# EAGLE board lower_pcb (EAGLE 9.6.2), part 1 of 2
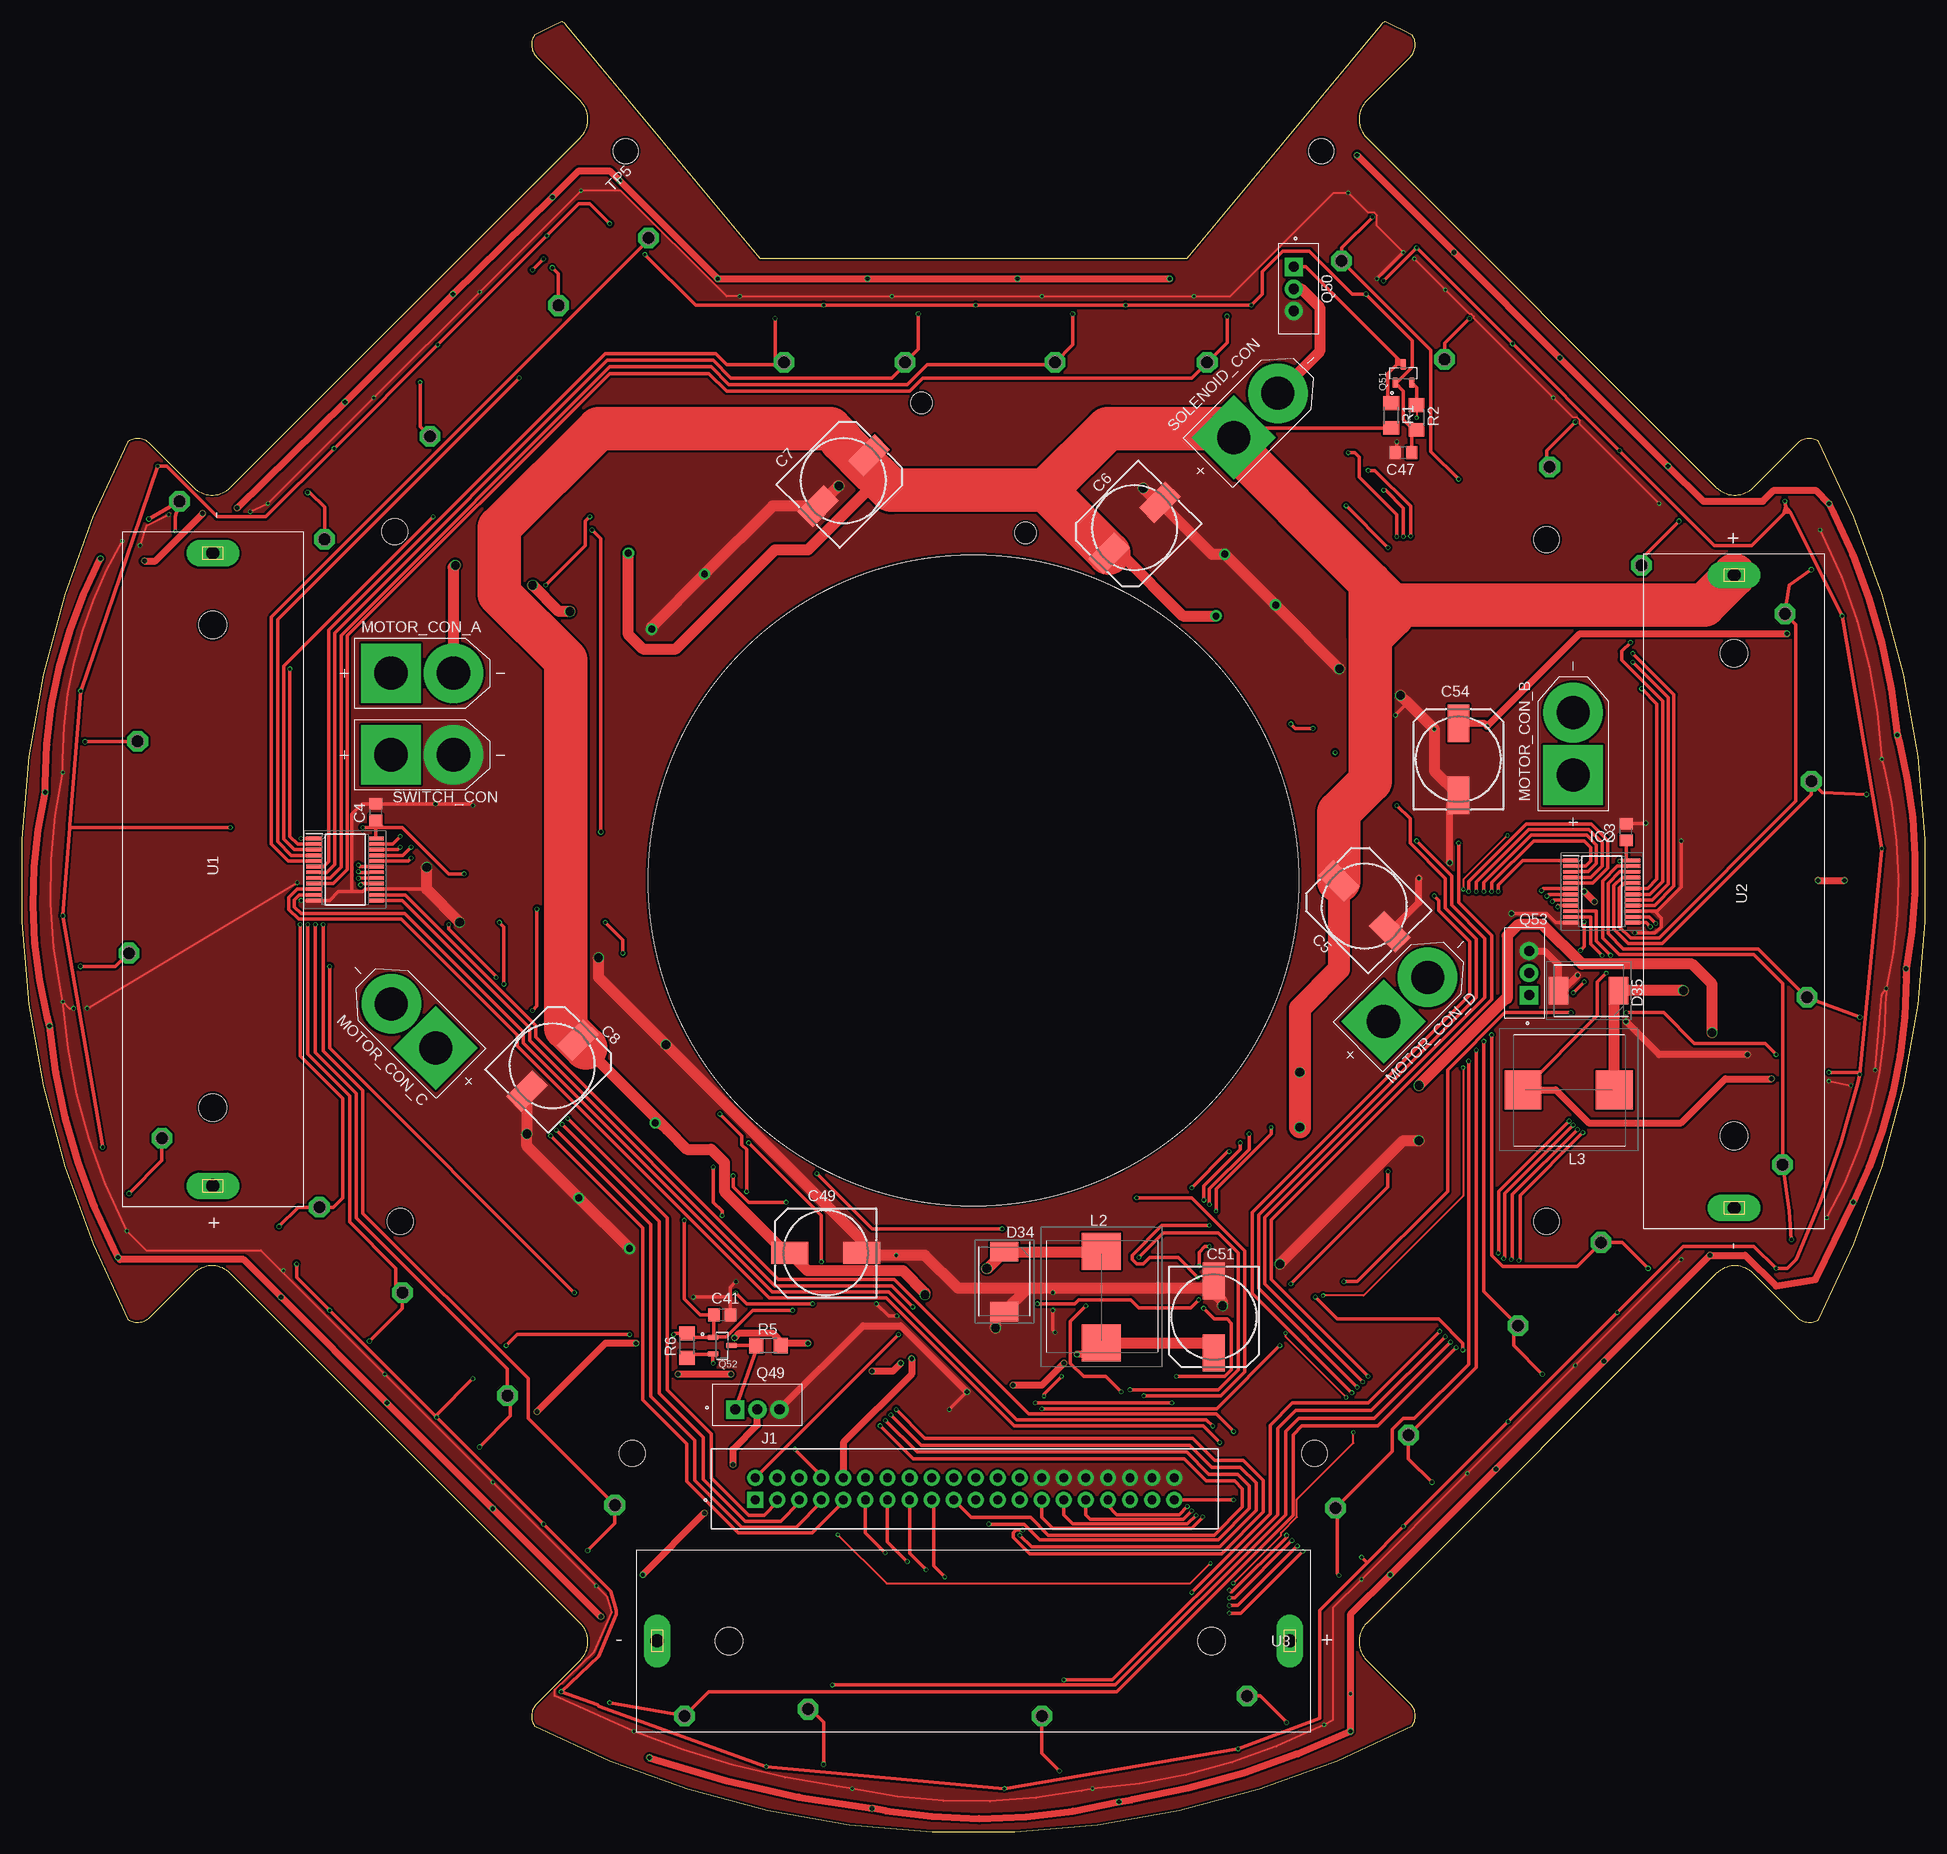
[diagram p2: board, top side]
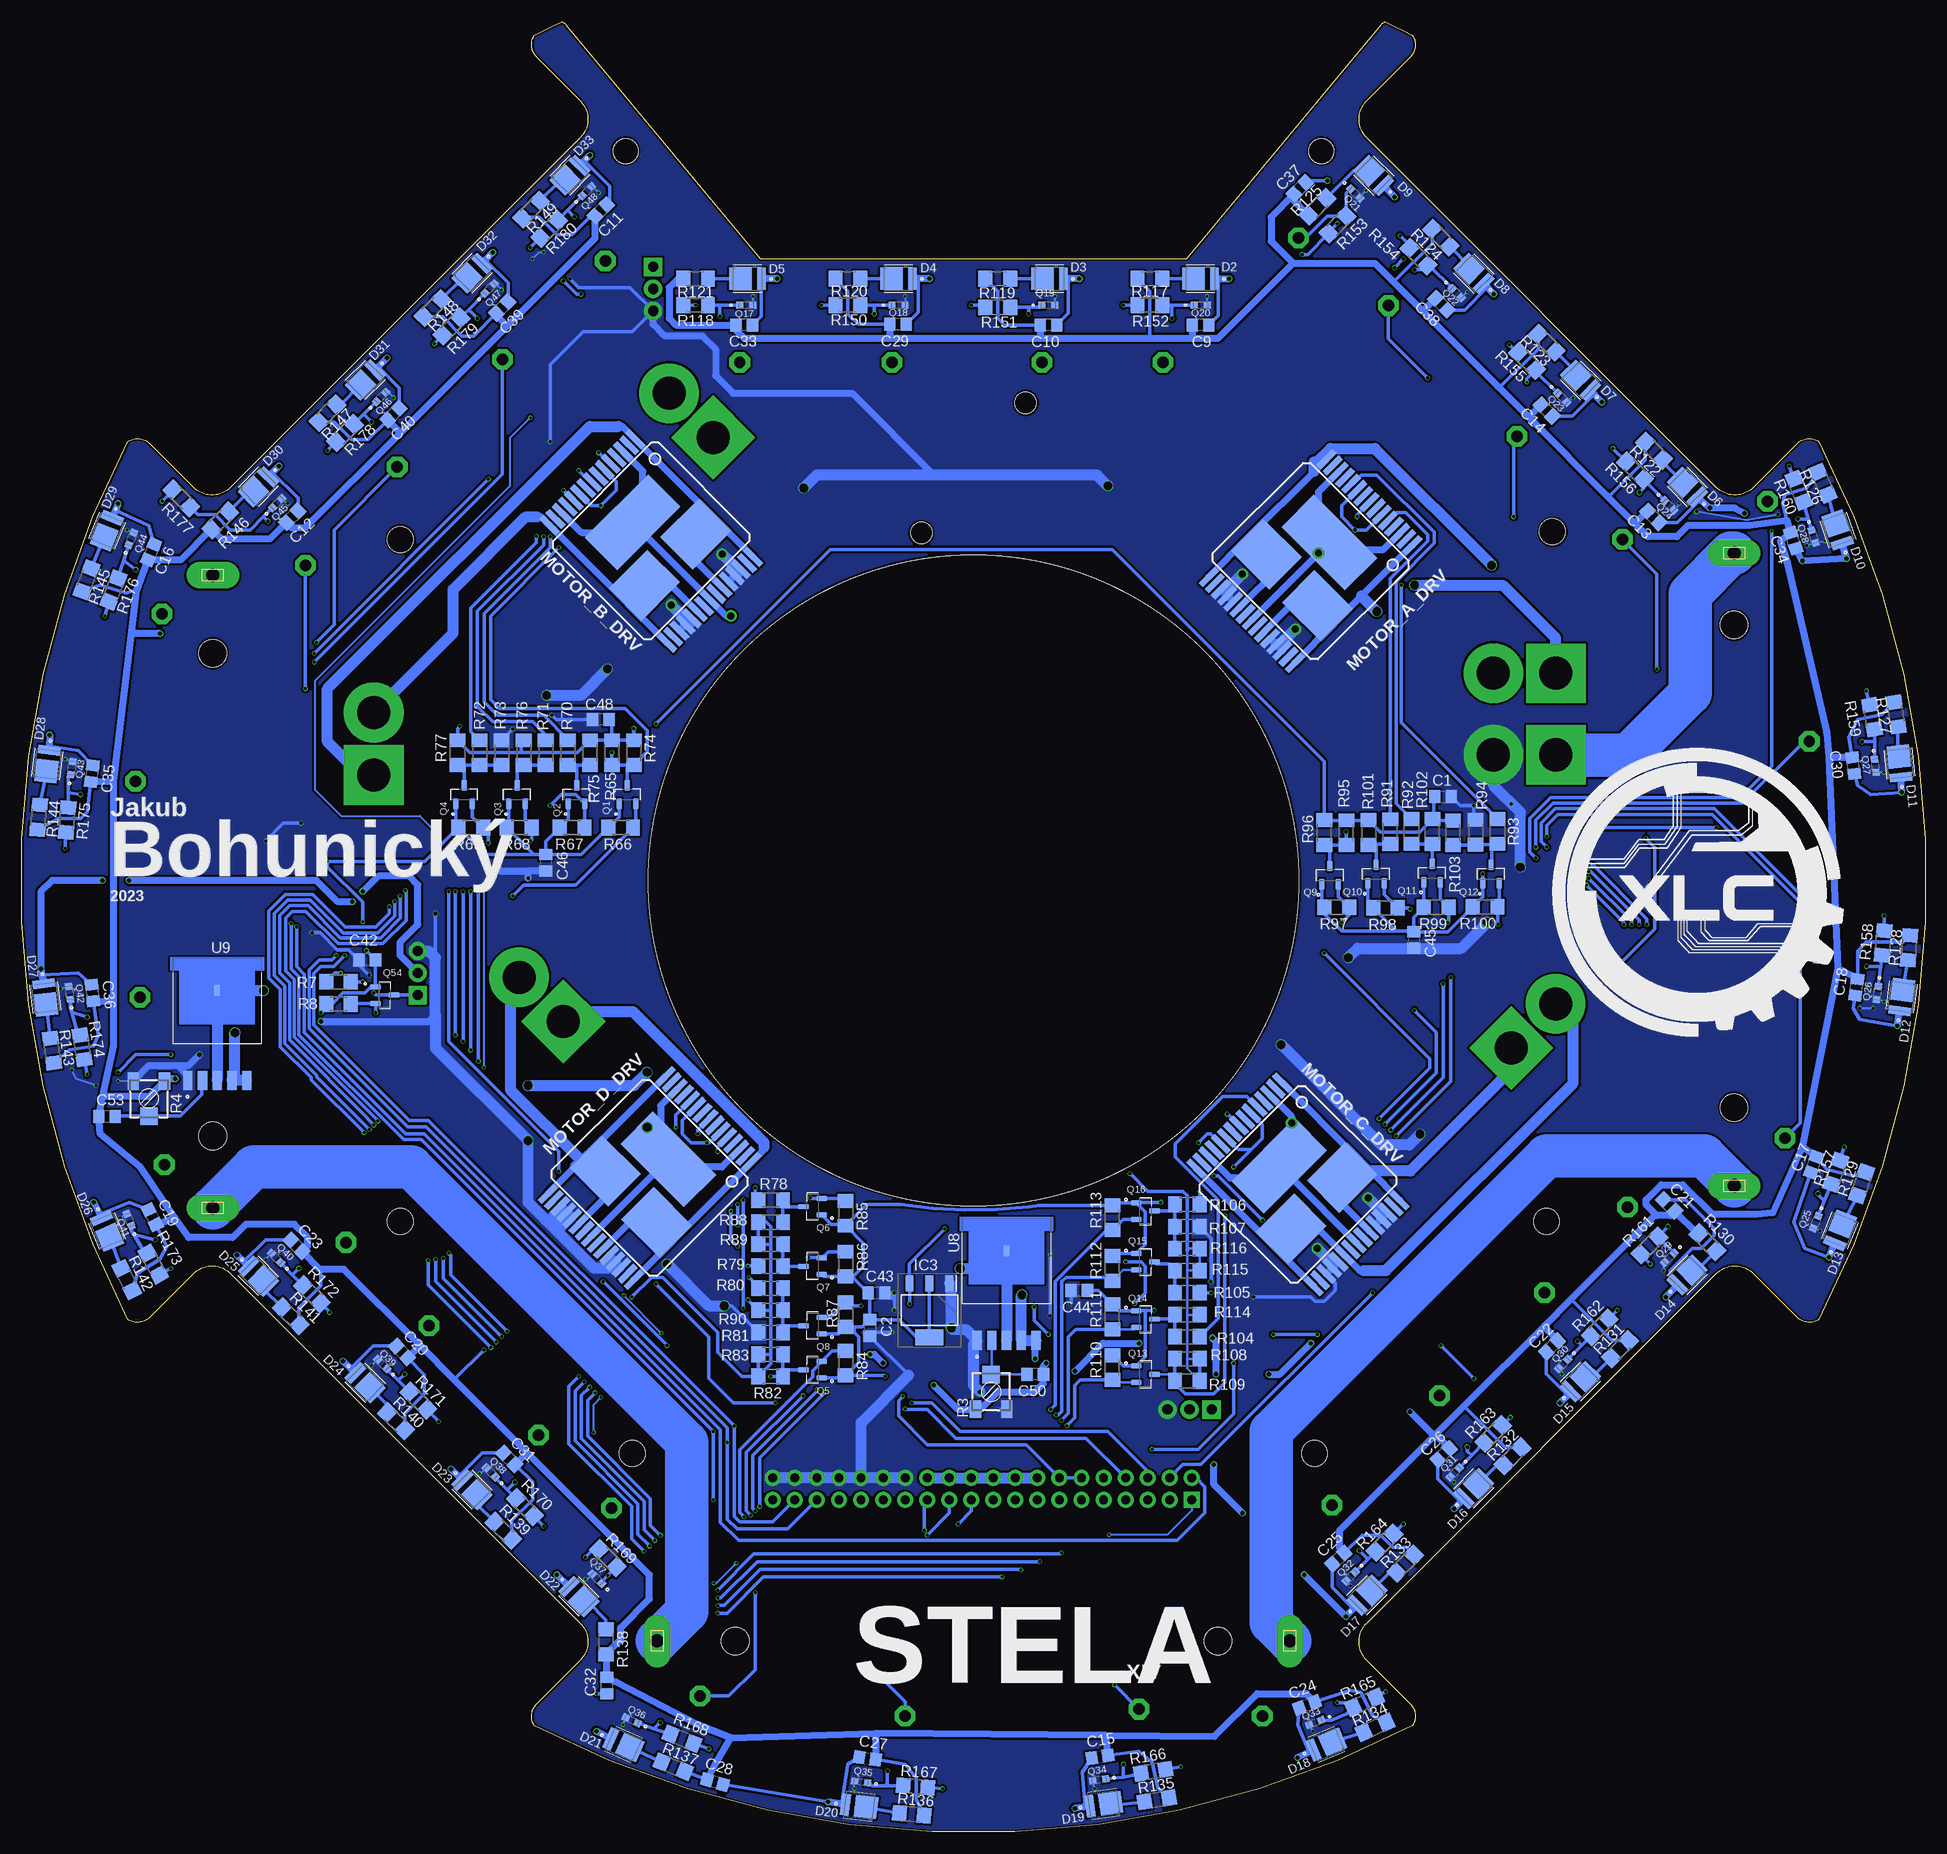
[diagram p3: board, bottom side, seen from below]

Size 219.29 x 208.61 mm. Coordinates in mm from the lower left corner, seen from the top.
Outline: 195.24,154.94 154.94,195.24 arc-90 154.94,199.48 159.97,204.52 arc79 160.22,207.05 arc2 157.1,208.61 arc35 156.6,208.28 134.2,181.3 85.09,181.3 62.69,208.28 arc35 62.19,208.61 arc2 59.07,207.05 arc79 59.32,204.52 64.36,199.48 arc-90 64.36,195.24 24.05,154.94 arc-90 19.81,154.94 14.77,159.97 arc79 12.24,160.22 arc55 12.24,59.07 arc79 14.77,59.32 19.81,64.36 arc-90 24.05,64.36 64.36,24.05 arc-90 64.36,19.81 59.32,14.77 arc79 59.07,12.24 arc55 160.22,12.24 arc79 159.97,14.77 154.94,19.81 arc-90 154.94,24.05 195.24,64.36 arc-90 199.48,64.36 204.52,59.32 arc79 207.05,59.07 arc55 207.05,160.22 arc79 204.52,159.97 199.48,154.94 arc-90 195.24,154.94
Copper layers (1*16): Top 0.035mm / dielectric 1.6mm / Bottom 0.035mm
Design rules "jlc_pcb": minimum track width 5mil, minimum drill 0.3mm, track to track 5mil, track to pad 5mil, pad to pad 5mil, via to via 5mil, smd to smd 5mil, copper to edge 0.2mm, drill to drill 6mil, minimum pad ring 10mil, minimum via ring 3mil, stop-mask expansion 4mil, vias tented up to drill 0mil, thermal gap 10mil
Holes 2.5 mm at 103.65,164.68 115.65,149.68
Holes 2.9 mm at 149.72,193.7 69.58,193.7
Holes 3 mm at 43.63,70.35 148.94,43.63 42.95,149.84 175.66,70.35 70.35,43.63 175.66,148.94
Holes 75 mm at 109.65,109.65

## Footprints (pad centres in the part's own frame; a part is rotated, then mirrored left to right if it is on the bottom)
C0805 = smd 1.3 x 1.5: 1 -0.95,0; 2 0.95,0
150CLZ-1010 = smd 4.3 x 2.5: + 4.15,0; - -4.15,0
LED_OF-SMD2835Y = smd 2.6 x 2.55: A 0.8,0 | smd 1 x 2.55: C -1.6,0
DIOM8059X256N = smd 2.25 x 3.2: 1 -3.45,0; 2 3.45,0
SOP65P780X200-24N = smd 1.8 x 0.45: 1 -3.55,3.575; 2 -3.55,2.925; 3 -3.55,2.275; 4 -3.55,1.625; 5 -3.55,0.975; 6 -3.55,0.325; 7 -3.55,-0.325; 8 -3.55,-0.975; 9 -3.55,-1.625; 10 -3.55,-2.275; 11 -3.55,-2.925; 12 -3.55,-3.575; 13 3.55,-3.575; 14 3.55,-2.925; 15 3.55,-2.275; 16 3.55,-1.625; 17 3.55,-0.975; 18 3.55,-0.325; 19 3.55,0.325; 20 3.55,0.975; 21 3.55,1.625; 22 3.55,2.275; 23 3.55,2.925; 24 3.55,3.575
SOT230P700X180-4N = smd 1.85 x 0.9: 1 -3.1,2.3; 2 -3.1,0; 3 -3.1,-2.3 | smd 1.85 x 3.2: 4 3.1,0
SAMTEC_TST-120-02-S-D = drill 1.02 pad 1.37 square: 01 0,0 | drill 1.02 pad 1.37: 02 0,2.54; 03 2.54,0; 04 2.54,2.54; 05 5.08,0; 06 5.08,2.54; 07 7.62,0; 08 7.62,2.54; 09 10.16,0; 10 10.16,2.54; 11 12.7,0; 12 12.7,2.54; 13 15.24,0; 14 15.24,2.54; 15 17.78,0; 16 17.78,2.54; 17 20.32,0; 18 20.32,2.54; 19 22.86,0; 20 22.86,2.54; 21 25.4,0; 22 25.4,2.54; 23 27.94,0; 24 27.94,2.54; 25 30.48,0; 26 30.48,2.54; 27 33.02,0; 28 33.02,2.54; 29 35.56,0; 30 35.56,2.54; 31 38.1,0; 32 38.1,2.54; 33 40.64,0; 34 40.64,2.54; 35 43.18,0; 36 43.18,2.54; 37 45.72,0; 38 45.72,2.54; 39 48.26,0; 40 48.26,2.54
WE-HCI_1350/136523 = smd 4.25 x 4.5: 1 -5.25,0; 2 5.27,0
MULTIPOWER30 = smd 10.3 x 5.25: 31 0,-3.05 | smd 6.23 x 5.25: 32 4.165,3.05; 33 -4.165,3.05 | smd 0.68 x 2.6: P$1 -7,-9.6; P$2 -6,-9.6; P$3 -5,-9.6; P$4 -4,-9.6; P$5 -3,-9.6; P$6 -2,-9.6; P$7 -1,-9.6; P$8 0,-9.6; P$9 1,-9.6; P$10 2,-9.6; P$11 3,-9.6; P$12 4,-9.6; P$13 5,-9.6; P$14 6,-9.6; P$15 7,-9.6; P$16 7,9.6; P$17 6,9.6; P$18 5,9.6; P$19 4,9.6; P$20 3,9.6; P$21 2,9.6; P$22 1,9.6; P$23 0,9.6; P$24 -1,9.6; P$25 -2,9.6; P$26 -3,9.6; P$27 -4,9.6; P$28 -5,9.6; P$29 -6,9.6; P$30 -7,9.6
AMASS_XT60-M = drill 3.81 pad 3.886: N 3.6,0 | drill 3.81 pad 3.886 square: P -3.6,0
SOT95P240X111-3N = smd 1.23 x 0.6: 1 -1.06,0.95; 2 -1.06,-0.95; 3 1.06,0
XDCR_PT19-21B/L41/TR8 = smd 0.8 x 0.8: C -0.75,0; E 0.75,0
TO254P1036X470X1965-3 = drill 1.17 square: 1 -2.54,0 | drill 1.17: 2 0,0; 3 2.54,0
R1206 = smd 1.6 x 1.803: 1 -1.422,0; 2 1.422,0
RTRIM3314J = smd 1.3 x 2: 1 1.8,-2; 3 -1.8,-2 | smd 2 x 2: 2 0,2
P1-13 = drill 1.321 pad 2.159 octagon: TP 0,0
BAT_BH-18650-PC = drill 1.524 pad 3.048 long: N -36.45,0; P 36.45,0 | hole 3.2: -28.17,0; 27.44,0
CONV_XL4015 = smd 2.16 x 1.07: 1 -10.335,3.4; 2 -10.335,1.7; 3 -10.335,0; 4 -10.335,-1.7; 5 -10.335,-3.4 | smd 1.27 x 0.635: 3.1 0,0

## Placement (x,y rotation side)
C1  100nF  [C0805]  55.54,119.3 0 bottom
C2  100nF  [C0805]  121.58,58.08 270 bottom
C3  100nF  [C0805]  184.83,115.23 90 top
C4  100nF  [C0805]  40.81,117.52 90 top
C5  470uF  [150CLZ-1010]  154.68,106.67 135 top
C6  470uF  [150CLZ-1010]  128.19,150.29 225 top
C7  470uF  [150CLZ-1010]  94.68,155.73 45 top
C8  470uF  [150CLZ-1010]  61.13,88.31 45 top
C9  100nF  [C0805]  83.48,173.65 180 bottom
C10  100nF  [C0805]  101.01,173.65 180 bottom
C11  100nF  [C0805]  152.57,186.86 225 bottom
C12  100nF  [C0805]  188.13,151.56 225 bottom
C13  100nF  [C0805]  31.33,151.53 135 bottom
C14  100nF  [C0805]  43.61,163.8 135 bottom
C15  100nF  [C0805]  95.09,8.67 9 bottom
C16  100nF  [C0805]  204.39,147.49 247 bottom
C17  100nF  [C0805]  12.85,76.89 70 bottom
C18  100nF  [C0805]  7.93,97.34 82 bottom
C19  100nF  [C0805]  204.25,70.85 296 bottom
C20  100nF  [C0805]  175.48,55.31 314 bottom
C21  100nF  [C0805]  29.5,72.21 315 bottom
C22  100nF  [C0805]  42.99,55.96 45 bottom
C23  100nF  [C0805]  187.64,67.55 315 bottom
C24  100nF  [C0805]  71.22,14.63 21 bottom
C25  100nF  [C0805]  67.61,31.51 43 bottom
C26  100nF  [C0805]  55.49,43.55 44 bottom
C27  100nF  [C0805]  121.86,8.48 352 bottom
C28  100nF  [C0805]  139.42,5.75 164 bottom
C29  100nF  [C0805]  118.33,173.72 180 bottom
C30  100nF  [C0805]  8.29,122.88 97 bottom
C31  100nF  [C0805]  163.13,43.01 315 bottom
C32  100nF  [C0805]  151.89,16.88 90 bottom
C33  100nF  [C0805]  136.06,173.65 180 bottom
C34  100nF  [C0805]  15.21,148.82 109 bottom
C35  100nF  [C0805]  211.21,121.96 263 bottom
C36  100nF  [C0805]  211.16,96.69 276 bottom
C37  100nF  [C0805]  72.05,189.4 225 bottom
C38  100nF  [C0805]  55.74,176.05 135 bottom
C39  100nF  [C0805]  163.94,175.66 225 bottom
C40  100nF  [C0805]  176.46,163.39 225 bottom
C41  100nF  [C0805]  80.69,59.61 0 top
C42  100nF  [C0805]  179.5,100.5 180 bottom
C43  100nF  [C0805]  120.82,62.15 0 bottom
C44  100nF  [C0805]  97.45,62.4 180 bottom
C45  100nF  [C0805]  58.93,102.77 270 bottom
C46  100nF  [C0805]  158.92,111.68 270 bottom
C47  100nF  [C0805]  159.18,158.92 180 top
C48  100nF  [C0805]  152.57,128.19 180 bottom
C49  470uF  [150CLZ-1010]  92.63,66.72 180 top
C50  100nF  [C0805]  102.53,52.75 180 bottom
C51  470uF  [150CLZ-1010]  137.33,59.35 270 top
C53  100nF  [C0805]  209.47,82.47 0 bottom
C54  470uF  [150CLZ-1010]  165.53,123.62 90 top
D2  OF-SMD2835Y  [LED_OF-SMD2835Y]  83.48,178.99 180 bottom
D3  OF-SMD2835Y  [LED_OF-SMD2835Y]  100.88,178.99 180 bottom
D4  OF-SMD2835Y  [LED_OF-SMD2835Y]  118.28,178.99 180 bottom
D5  OF-SMD2835Y  [LED_OF-SMD2835Y]  135.68,178.99 180 bottom
D6  OF-SMD2835Y  [LED_OF-SMD2835Y]  27.39,154.98 135 bottom
D7  OF-SMD2835Y  [LED_OF-SMD2835Y]  39.7,167.28 135 bottom
D8  OF-SMD2835Y  [LED_OF-SMD2835Y]  52,179.58 135 bottom
D9  OF-SMD2835Y  [LED_OF-SMD2835Y]  63.54,190.87 135 bottom
D10  OF-SMD2835Y  [LED_OF-SMD2835Y]  10.08,150.03 109 bottom
D11  OF-SMD2835Y  [LED_OF-SMD2835Y]  2.97,123.13 96 bottom
D12  OF-SMD2835Y  [LED_OF-SMD2835Y]  2.71,96.23 82 bottom
D13  OF-SMD2835Y  [LED_OF-SMD2835Y]  9.82,69.33 68 bottom
D14  OF-SMD2835Y  [LED_OF-SMD2835Y]  27.42,64.2 45 bottom
D15  OF-SMD2835Y  [LED_OF-SMD2835Y]  39.73,51.89 45 bottom
D16  OF-SMD2835Y  [LED_OF-SMD2835Y]  52.03,39.59 45 bottom
D17  OF-SMD2835Y  [LED_OF-SMD2835Y]  64.33,27.29 45 bottom
D18  OF-SMD2835Y  [LED_OF-SMD2835Y]  69.01,10.08 23 bottom
D19  OF-SMD2835Y  [LED_OF-SMD2835Y]  94.64,3.22 8 bottom
D20  OF-SMD2835Y  [LED_OF-SMD2835Y]  122.81,2.97 353 bottom
D21  OF-SMD2835Y  [LED_OF-SMD2835Y]  149.96,10.08 336 bottom
D22  OF-SMD2835Y  [LED_OF-SMD2835Y]  155.11,27.15 315 bottom
D23  OF-SMD2835Y  [LED_OF-SMD2835Y]  167.42,39.46 315 bottom
D24  OF-SMD2835Y  [LED_OF-SMD2835Y]  179.72,51.76 315 bottom
D25  OF-SMD2835Y  [LED_OF-SMD2835Y]  192.02,64.06 315 bottom
D26  OF-SMD2835Y  [LED_OF-SMD2835Y]  209.47,69.26 293 bottom
D27  OF-SMD2835Y  [LED_OF-SMD2835Y]  216.58,96.16 277 bottom
D28  OF-SMD2835Y  [LED_OF-SMD2835Y]  216.33,123.06 263 bottom
D29  OF-SMD2835Y  [LED_OF-SMD2835Y]  209.47,149.96 248 bottom
D30  OF-SMD2835Y  [LED_OF-SMD2835Y]  192.01,155.02 225 bottom
D31  OF-SMD2835Y  [LED_OF-SMD2835Y]  179.71,167.33 225 bottom
D32  OF-SMD2835Y  [LED_OF-SMD2835Y]  167.41,179.63 225 bottom
D33  OF-SMD2835Y  [LED_OF-SMD2835Y]  156.12,190.92 225 bottom
D34  SS34  [DIOM8059X256N]  113.2,63.42 270 top
D35  SS34  [DIOM8059X256N]  180.51,96.95 180 top
IC1  CD74HC4067SM96  [SOP65P780X200-24N]  37.26,110.92 0 top
IC2  CD74HC4067SM96  [SOP65P780X200-24N]  182.04,108.38 0 top
IC3  AZ1117CH-3.3TRG1  [SOT230P700X180-4N]  114.73,60.12 270 bottom
J1  TST-120-02-S-D  [SAMTEC_TST-120-02-S-D]  84.5,38.27 0 top
L2  33uH  [WE-HCI_1350/136523]  124.38,61.64 270 top
L3  33uH  [WE-HCI_1350/136523]  178.23,85.52 180 top
MOTOR_A_DRV  VNH2SP30  [MULTIPOWER30]  70.81,146.45 135 bottom
MOTOR_B_DRV  VNH2SP30  [MULTIPOWER30]  146.77,148.76 225 bottom
MOTOR_C_DRV  VNH2SP30  [MULTIPOWER30]  72.26,74.62 225 bottom
MOTOR_CON_A  XT60-M  [AMASS_XT60-M]  46.15,133.52 0 top
MOTOR_CON_B  XT60-M  [AMASS_XT60-M]  178.73,125.39 90 top
MOTOR_CON_C  XT60-M  [AMASS_XT60-M]  45.13,92.88 135 top
MOTOR_CON_D  XT60-M  [AMASS_XT60-M]  159.43,95.93 45 top
MOTOR_D_DRV  VNH2SP30  [MULTIPOWER30]  146.95,75.37 135 bottom
Q1  BSS138  [SOT95P240X111-3N]  149.52,119.55 90 bottom
Q2  BSS138  [SOT95P240X111-3N]  155.37,119.55 90 bottom
Q3  BSS138  [SOT95P240X111-3N]  162.22,119.55 90 bottom
Q4  BSS138  [SOT95P240X111-3N]  168.32,119.55 90 bottom
Q5  BSS138  [SOT95P240X111-3N]  128.19,53.26 180 bottom
Q6  BSS138  [SOT95P240X111-3N]  128.19,72.05 180 bottom
Q7  BSS138  [SOT95P240X111-3N]  128.19,65.2 180 bottom
Q8  BSS138  [SOT95P240X111-3N]  128.19,58.34 180 bottom
Q9  BSS138  [SOT95P240X111-3N]  68.58,110.26 90 bottom
Q10  BSS138  [SOT95P240X111-3N]  63.27,110.39 90 bottom
Q11  BSS138  [SOT95P240X111-3N]  56.82,110.52 90 bottom
Q12  BSS138  [SOT95P240X111-3N]  50.02,110.39 90 bottom
Q13  BSS138  [SOT95P240X111-3N]  89.83,52.75 0 bottom
Q14  BSS138  [SOT95P240X111-3N]  89.83,59.1 0 bottom
Q15  BSS138  [SOT95P240X111-3N]  89.83,65.7 0 bottom
Q16  BSS138  [SOT95P240X111-3N]  89.83,71.55 0 bottom
Q17  PT19-21B/L41/TR8  [XDCR_PT19-21B/L41/TR8]  135.81,175.94 0 bottom
Q18  PT19-21B/L41/TR8  [XDCR_PT19-21B/L41/TR8]  118.28,175.94 0 bottom
Q19  PT19-21B/L41/TR8  [XDCR_PT19-21B/L41/TR8]  101.01,175.94 0 bottom
Q20  PT19-21B/L41/TR8  [XDCR_PT19-21B/L41/TR8]  83.48,175.94 0 bottom
Q21  PT19-21B/L41/TR8  [XDCR_PT19-21B/L41/TR8]  65.67,188.8 315 bottom
Q22  PT19-21B/L41/TR8  [XDCR_PT19-21B/L41/TR8]  53.97,177.35 315 bottom
Q23  PT19-21B/L41/TR8  [XDCR_PT19-21B/L41/TR8]  41.83,165.27 315 bottom
Q24  PT19-21B/L41/TR8  [XDCR_PT19-21B/L41/TR8]  29.5,152.87 315 bottom
Q25  PT19-21B/L41/TR8  [XDCR_PT19-21B/L41/TR8]  12.62,70.28 248 bottom
Q26  PT19-21B/L41/TR8  [XDCR_PT19-21B/L41/TR8]  5.51,96.69 262 bottom
Q27  PT19-21B/L41/TR8  [XDCR_PT19-21B/L41/TR8]  5.76,122.85 276 bottom
Q28  PT19-21B/L41/TR8  [XDCR_PT19-21B/L41/TR8]  12.87,149.27 287 bottom
Q29  PT19-21B/L41/TR8  [XDCR_PT19-21B/L41/TR8]  29.47,66.18 225 bottom
Q30  PT19-21B/L41/TR8  [XDCR_PT19-21B/L41/TR8]  41.71,53.94 225 bottom
Q31  PT19-21B/L41/TR8  [XDCR_PT19-21B/L41/TR8]  54.2,41.45 225 bottom
Q32  PT19-21B/L41/TR8  [XDCR_PT19-21B/L41/TR8]  66.18,29.47 225 bottom
Q33  PT19-21B/L41/TR8  [XDCR_PT19-21B/L41/TR8]  70.28,12.62 202 bottom
Q34  PT19-21B/L41/TR8  [XDCR_PT19-21B/L41/TR8]  95.17,6.01 189 bottom
Q35  PT19-21B/L41/TR8  [XDCR_PT19-21B/L41/TR8]  122.6,5.76 172 bottom
Q36  PT19-21B/L41/TR8  [XDCR_PT19-21B/L41/TR8]  149.02,12.87 155 bottom
Q37  PT19-21B/L41/TR8  [XDCR_PT19-21B/L41/TR8]  153.02,29.19 135 bottom
Q38  PT19-21B/L41/TR8  [XDCR_PT19-21B/L41/TR8]  165.26,41.43 135 bottom
Q39  PT19-21B/L41/TR8  [XDCR_PT19-21B/L41/TR8]  177.75,53.92 135 bottom
Q40  PT19-21B/L41/TR8  [XDCR_PT19-21B/L41/TR8]  189.98,66.16 135 bottom
Q41  PT19-21B/L41/TR8  [XDCR_PT19-21B/L41/TR8]  206.93,70.53 112 bottom
Q42  PT19-21B/L41/TR8  [XDCR_PT19-21B/L41/TR8]  213.79,96.69 97 bottom
Q43  PT19-21B/L41/TR8  [XDCR_PT19-21B/L41/TR8]  213.53,122.6 82 bottom
Q44  PT19-21B/L41/TR8  [XDCR_PT19-21B/L41/TR8]  206.67,149.02 68 bottom
Q45  PT19-21B/L41/TR8  [XDCR_PT19-21B/L41/TR8]  189.87,153.13 45 bottom
Q46  PT19-21B/L41/TR8  [XDCR_PT19-21B/L41/TR8]  177.89,165.37 45 bottom
Q47  PT19-21B/L41/TR8  [XDCR_PT19-21B/L41/TR8]  165.4,177.86 45 bottom
Q48  PT19-21B/L41/TR8  [XDCR_PT19-21B/L41/TR8]  154.18,189.08 45 bottom
Q49  CSD19503KCS  [TO254P1036X470X1965-3]  84.75,48.69 0 top
Q50  CSD19503KCS  [TO254P1036X470X1965-3]  146.55,177.82 270 top
Q51  BSS138  [SOT95P240X111-3N]  159.18,168.07 90 top
Q52  BSS138  [SOT95P240X111-3N]  80.69,56.05 0 top
Q53  CSD19503KCS  [TO254P1036X470X1965-3]  173.65,98.98 90 top
Q54  BSS138  [SOT95P240X111-3N]  177.46,96.44 0 bottom
R1  10k  [R1206]  157.78,163.21 270 top
R2  10k  [R1206]  160.7,162.99 270 top
R3  10K  [RTRIM3314J]  107.61,50.72 0 bottom
R4  10K  [RTRIM3314J]  204.64,84.5 180 bottom
R5  10k  [R1206]  86.02,56.05 0 top
R6  10k  [R1206]  76.63,56.05 90 top
R7  10k  [R1206]  182.8,97.96 180 bottom
R8  10k  [R1206]  182.8,95.42 180 bottom
R65  10k  [R1206]  151.3,124.38 90 bottom
R66  10k  [R1206]  150.29,115.74 180 bottom
R67  10k  [R1206]  155.87,115.74 180 bottom
R68  10k  [R1206]  161.97,115.74 180 bottom
R69  10k  [R1206]  167.56,115.74 180 bottom
R70  1k  [R1206]  156.38,124.38 90 bottom
R71  1k  [R1206]  158.92,124.38 90 bottom
R72  1k  [R1206]  166.54,124.38 270 bottom
R73  10k  [R1206]  164,124.38 90 bottom
R74  4.7k  [R1206]  148.76,124.38 90 bottom
R75  10k  [R1206]  153.84,124.38 90 bottom
R76  10k  [R1206]  161.46,124.38 90 bottom
R77  10k  [R1206]  169.08,124.38 90 bottom
R78  1k  [R1206]  133.01,72.82 180 bottom
R79  1k  [R1206]  133.01,65.2 180 bottom
R80  1k  [R1206]  133.01,62.66 0 bottom
R81  10k  [R1206]  133.01,57.58 180 bottom
R82  4.7k  [R1206]  133.01,52.5 180 bottom
R83  10k  [R1206]  133.01,55.04 180 bottom
R84  10k  [R1206]  124.38,54.02 270 bottom
R85  10k  [R1206]  124.38,71.29 270 bottom
R86  10k  [R1206]  124.38,65.45 270 bottom
R87  10k  [R1206]  124.38,59.61 270 bottom
R88  10k  [R1206]  133.01,70.28 180 bottom
R89  10k  [R1206]  133.01,67.74 180 bottom
R90  10k  [R1206]  133.01,60.12 180 bottom
R91  1k  [R1206]  61.62,115.27 90 bottom
R92  1k  [R1206]  59.18,115.29 90 bottom
R93  1k  [R1206]  49.28,115.3 270 bottom
R94  10k  [R1206]  51.8,115.22 90 bottom
R95  4.7k  [R1206]  66.68,115.16 90 bottom
R96  10k  [R1206]  69.24,115.17 90 bottom
R97  10k  [R1206]  67.8,106.56 180 bottom
R98  10k  [R1206]  62.18,106.48 180 bottom
R99  10k  [R1206]  56.33,106.56 180 bottom
R100  10k  [R1206]  50.7,106.61 180 bottom
R101  10k  [R1206]  64.13,115.17 90 bottom
R102  10k  [R1206]  56.78,115.28 90 bottom
R103  10k  [R1206]  54.41,115.14 90 bottom
R104  1k  [R1206]  85.01,57.07 0 bottom
R105  1k  [R1206]  85.01,62.15 0 bottom
R106  1k  [R1206]  85.01,72.31 180 bottom
R107  10k  [R1206]  85.01,69.77 0 bottom
R108  4.7k  [R1206]  85.01,54.53 0 bottom
R109  10k  [R1206]  85.01,51.99 0 bottom
R110  10k  [R1206]  93.64,53.51 90 bottom
R111  10k  [R1206]  93.64,59.35 90 bottom
R112  10k  [R1206]  93.64,64.94 90 bottom
R113  10k  [R1206]  93.64,70.78 90 bottom
R114  10k  [R1206]  85.01,59.61 0 bottom
R115  10k  [R1206]  85.01,64.69 0 bottom
R116  10k  [R1206]  85.01,67.23 0 bottom
R117  10R  [R1206]  89.33,178.99 180 bottom
R118  10k  [R1206]  141.65,175.94 0 bottom
R119  10R  [R1206]  106.85,178.99 180 bottom
R120  10R  [R1206]  124.12,178.99 180 bottom
R121  10R  [R1206]  141.65,178.99 180 bottom
R122  10R  [R1206]  31.26,159.17 135 bottom
R123  10R  [R1206]  43.61,171.62 135 bottom
R124  10R  [R1206]  55.81,183.71 135 bottom
R125  10R  [R1206]  70,187.28 225 bottom
R126  10R  [R1206]  11.8,155.42 114 bottom
R127  10R  [R1206]  3.37,128.77 99 bottom
R128  10R  [R1206]  1.87,101.89 85 bottom
R129  10R  [R1206]  7.33,74.68 71 bottom
R130  10R  [R1206]  25.1,67.95 135 bottom
R131  10R  [R1206]  35.18,55.66 45 bottom
R132  10R  [R1206]  47.54,43.3 45 bottom
R133  10R  [R1206]  59.91,30.93 45 bottom
R134  10R  [R1206]  63.38,12.07 24 bottom
R135  10R  [R1206]  88.53,3.72 9 bottom
R136  10R  [R1206]  116.76,2.04 355 bottom
R137  10R  [R1206]  144.23,7.52 338 bottom
R138  10R  [R1206]  151.98,21.91 270 bottom
R139  10R  [R1206]  163.82,34.71 315 bottom
R140  10R  [R1206]  176.18,47.33 315 bottom
R141  10R  [R1206]  188.29,59.44 315 bottom
R142  10R  [R1206]  207.18,63.67 296 bottom
R143  10R  [R1206]  215.8,90.05 278 bottom
R144  10R  [R1206]  217.34,116.93 265 bottom
R145  10R  [R1206]  211.81,144.3 249 bottom
R146  10R  [R1206]  196.42,151.13 225 bottom
R147  10R  [R1206]  184.06,163.49 225 bottom
R148  10R  [R1206]  171.95,175.6 225 bottom
R149  10R  [R1206]  160.6,186.95 225 bottom
R150  10k  [R1206]  124.12,175.94 0 bottom
R151  10k  [R1206]  106.85,175.69 0 bottom
R152  10k  [R1206]  89.33,175.94 0 bottom
R153  10k  [R1206]  67.72,185.21 45 bottom
R154  10k  [R1206]  58.39,181.52 315 bottom
R155  10k  [R1206]  45.86,169.5 315 bottom
R156  10k  [R1206]  33.45,156.89 315 bottom
R157  10k  [R1206]  10.33,76.01 250 bottom
R158  10k  [R1206]  4.84,102.44 265 bottom
R159  10k  [R1206]  6.13,128.48 280 bottom
R160  10k  [R1206]  14.56,154.61 292 bottom
R161  10k  [R1206]  31.76,67.59 45 bottom
R162  10k  [R1206]  37.5,58.15 225 bottom
R163  10k  [R1206]  49.77,45.88 225 bottom
R164  10k  [R1206]  62.3,33.35 225 bottom
R165  10k  [R1206]  64.59,14.95 204 bottom
R166  10k  [R1206]  88.94,6.99 189 bottom
R167  10k  [R1206]  116.33,5.24 176 bottom
R168  10k  [R1206]  143.22,10.74 158 bottom
R169  10k  [R1206]  151.77,31.58 315 bottom
R170  10k  [R1206]  161.33,37.43 135 bottom
R171  10k  [R1206]  173.6,49.7 135 bottom
R172  10k  [R1206]  185.88,61.98 135 bottom
R173  10k  [R1206]  204.13,65.45 119 bottom
R174  10k  [R1206]  212.33,90.41 99 bottom
R175  10k  [R1206]  214.07,116.62 85 bottom
R176  10k  [R1206]  208.72,143.11 69 bottom
R177  10k  [R1206]  200.92,153.69 315 bottom
R178  10k  [R1206]  182.06,161.2 45 bottom
R179  10k  [R1206]  169.78,173.48 45 bottom
R180  10k  [R1206]  158.52,184.74 45 bottom
SOLENOID_CON  XT60-M  [AMASS_XT60-M]  142.16,163.24 45 top
SWITCH_CON  XT60-M  [AMASS_XT60-M]  46.15,124.12 0 top
TP1  PTR1PAD1-13  [P1-13]  136.57,169.34 0 top
TP2  PTR1PAD1-13  [P1-13]  119.04,169.34 0 top
TP3  PTR1PAD1-13  [P1-13]  101.77,169.34 0 top
TP4  PTR1PAD1-13  [P1-13]  87.8,169.34 0 top
TP5  PTR1PAD1-13  [P1-13]  72.19,183.68 45 top
TP6  PTR1PAD1-13  [P1-13]  61.84,175.89 45 top
TP7  PTR1PAD1-13  [P1-13]  47.04,160.83 45 top
TP8  PTR1PAD1-13  [P1-13]  34.89,148.94 45 top
TP9  PTR1PAD1-13  [P1-13]  16.16,79.95 90 top
TP10  PTR1PAD1-13  [P1-13]  12.35,101.28 90 top
TP11  PTR1PAD1-13  [P1-13]  13.36,125.67 90 top
TP12  PTR1PAD1-13  [P1-13]  18.19,153.35 90 top
TP13  PTR1PAD1-13  [P1-13]  34.28,71.98 135 top
TP14  PTR1PAD1-13  [P1-13]  43.85,62.16 135 top
TP15  PTR1PAD1-13  [P1-13]  55.96,50.3 135 top
TP16  PTR1PAD1-13  [P1-13]  68.33,37.68 135 top
TP17  PTR1PAD1-13  [P1-13]  76.37,13.38 180 top
TP18  PTR1PAD1-13  [P1-13]  90.6,14.14 180 top
TP19  PTR1PAD1-13  [P1-13]  117.52,13.38 180 top
TP20  PTR1PAD1-13  [P1-13]  141.14,15.67 180 top
TP21  PTR1PAD1-13  [P1-13]  151.34,37.33 225 top
TP22  PTR1PAD1-13  [P1-13]  159.76,45.75 225 top
TP23  PTR1PAD1-13  [P1-13]  172.37,58.37 225 top
TP24  PTR1PAD1-13  [P1-13]  181.94,67.94 225 top
TP25  PTR1PAD1-13  [P1-13]  202.86,76.88 270 top
TP26  PTR1PAD1-13  [P1-13]  205.66,96.18 270 top
TP27  PTR1PAD1-13  [P1-13]  206.17,121.08 270 top
TP28  PTR1PAD1-13  [P1-13]  203.12,140.38 0 top
TP29  PTR1PAD1-13  [P1-13]  186.62,145.96 315 top
TP30  PTR1PAD1-13  [P1-13]  176.03,157.31 315 top
TP31  PTR1PAD1-13  [P1-13]  163.92,169.67 315 top
TP32  PTR1PAD1-13  [P1-13]  152.06,181.02 315 top
U1  BH-18650-PC  [BAT_BH-18650-PC]  22.02,110.92 270 top
U2  BH-18650-PC  [BAT_BH-18650-PC]  197.28,108.38 90 top
U3  BH-18650-PC  [BAT_BH-18650-PC]  109.65,22.02 0 top
U8  XL4005  [CONV_XL4015]  105.84,66.97 90 bottom
U9  XL4005  [CONV_XL4015]  196.77,96.95 90 bottom

## Tracks (layer width: path | path; a pad name or v marks a point on that pad's centre or on a via)
+3V3  (via drill 0.3, 0.35, 0.4)
  Top 0.406: v67.74,185.34 65.45,187.62 64.18,187.62 v60.5,183.94 v47.92,171.37 v35.99,159.43 28.11,151.56 22.52,151.56 16.68,157.4 v15.67,157.4 12.84,149.11 6.87,131.59 v6.78,131.49 5.56,115.99 5.54,115.74 | 202.99,151.94 199.31,148.25 194.99,148.25 v184.07,159.18 v171.75,171.5 v160.7,182.54 v156.89,178.73 | 202.99,151.94 203.12,152.06 203.37,152.09 | v47.8,47.8 v60.12,35.48 67.84,27.76 68.5,25.57 68.5,25.06 66.47,20.24 v62.15,16.17 66.36,14.65 66.51,14.51 v85.77,7.54 v113.2,5 v140.13,9.57 149.52,13.13 149.52,25.57 154.99,31.03 | v31.67,65.45 31.67,63.93 v35.48,60.12 v47.8,47.8 | 5.54,115.74 v4.74,105.58 v9.32,78.91 | v211.75,87.29 214.29,113.2 v214.27,113.32 v209.72,140.13 203.73,152.12 | 203.37,152.09 203.73,152.12 | v203.12,153.33 203.24,152.75 | 203.24,152.75 | 203.24,152.75 203.37,152.09 | 203.24,152.75 203.73,152.12 | 203.24,152.75 202.99,151.94 | C3.1 184.83,111.95 IC2.24 184.07,111.95 v184.07,111.86 | IC1.24 C4.1 41.64,115.74 | 160.34,161.56 159.18,162.73 159.18,166.06 Q51.1 158.39,167.01 160.19,168.8 160.19,171.88 v154.86,177.21 153.28,177.21 148.33,182.16 145.28,182.16 142.92,179.8 142.92,177.21 v141.65,175.94 v127.17,175.94 v109.9,175.94 v92.37,175.94 77.64,175.94 v71.8,181.78 | 160.34,161.56 R2.2 | C47.1 160.13,161.35 160.34,161.56 | Q52.1 77.2,57 76.63,57.58 R6.2 75.25,57.47 v75.1,57.32 | Q52.1 79.74,57.11 C41.1 78.15,59.61 76.33,61.43 v76.33,70.49 | Q52.1 79.7,57.07 81.15,57.07 84.2,60.12 v88.82,60.12 | v211.75,87.29 211.5,86.28 arc-10 204.41,65.98 203.37,64.94 v202.1,64.94 199.56,67.48 191.43,67.48 v183.81,59.86 v171.24,47.29 v159.18,35.22 154.99,31.03
  Top 0.406: v154.35,31.67 154.99,31.03 | v117.77,50.21 117.77,50.46 v119.81,52.5 | 41.64,115.74 43.86,115.74 49.19,110.41 v50.97,110.41 | 41.64,115.74 v39.29,115.74 | v24.05,115.74 5.54,115.74 | v179.58,101.6 180,102.03 v180,104.87 | v70.02,57.32 57.07,57.32 v55.8,56.05 | v51.99,52.24 47.8,48.05 v47.8,47.8 | v184.83,94.41 189.15,94.41 192.7,90.85 200.83,90.85 v202.1,89.58 | v208.2,87.55 211.5,87.55 v211.75,87.29 | v88.06,72.56 83.74,72.56 81.96,74.34 v81.96,75.61
  Bottom 0.406: R156.1 v35.99,159.43 | v67.74,185.34 68.72,184.35 R153.1 71.15,181.78 v71.8,181.78 | v47.92,171.37 47.07,170.51 R155.1 | v60.5,183.94 59.39,182.84 R154.1 | R152.1 v92.37,175.94 | v141.65,175.94 R118.1 | v109.9,175.94 108.53,175.94 R151.1 | v127.17,175.94 R150.1 | R180.1 160.7,182.56 v160.7,182.54 | v203.12,153.33 201.92,154.53 R177.1 | R164.1 60.17,35.48 v60.12,35.48 | v31.67,65.45 31.67,65.48 R161.1 | v47.8,47.8 48.71,46.88 R163.1 | v35.48,60.12 36.44,59.16 R162.1 | R172.1 183.81,59.92 v183.81,59.86 | v154.35,31.67 153.44,32.58 R169.1 | v159.18,35.22 160.32,36.37 R170.1 | v171.24,47.29 172.6,48.65 R171.1 | R159.1 v6.78,131.49 | R158.1 v4.74,105.58 | v15.67,157.4 15.22,156.05 R160.1 | R157.1 v9.32,78.91 | R165.1 63.07,15.75 v62.15,16.17 | v140.13,9.57 R168.1 | R167.1 v113.2,5 | R166.1 v85.77,7.54 | R173.1 203.2,64.45 v202.1,64.94 | R174.1 v211.75,87.29 | R175.1 v214.27,113.32 | R176.1 v209.72,140.13 | Q5.1 124.67,52.31 R84.2 | R110.2 92.41,53.7 Q13.1 89.83,54.76 89.83,60.12 | R112.2 93.35,66.65 Q15.1 89.83,67.71 89.83,71.44 Q16.1 | Q16.1 93.35,72.5 R113.2 102.03,72.21 | C44.1 95.27,62.4 R111.2 92.92,60.05 Q14.1 90.83,60.12 89.83,60.12 | Q11.1 57.77,106.57 R99.2 58.93,105.38 C45.1 58.85,103.72 | Q10.1 64.22,107.1 R98.2 60.92,103.8 | Q9.1 69.53,106.87 R97.2 69.22,105.8 67.23,103.8 60.92,103.8 | 58.85,103.72 55.01,103.72 R100.2 50.97,107.75 Q12.1 v50.97,110.41 | 58.85,103.72 58.93,103.8 60.92,103.8 | Q4.1 169.27,116.03 R69.2 | Q3.1 163.17,115.96 R68.2 160.28,112.63 | Q2.1 156.32,116.72 R67.2 158.92,114.12 C46.1 | Q1.1 150.47,116.98 R66.2 154.82,112.63 C46.1 | 160.28,112.63 C46.1 | R69.2 165.87,112.63 160.28,112.63
  Bottom 0.406: v154.86,177.21 155.37,177.21 v156.89,178.73 | Q6.1 126.05,70.02 124.53,70.02 R85.2 | Q7.1 126.91,64.03 R86.2 123.65,64.03 | Q8.1 125.18,57.39 R87.2 123.62,58.19 | 123.65,64.03 C43.1 121.58,61.96 C2.1 | R85.2 122.35,67.84 122.35,65.2 123.51,64.03 123.65,64.03 | 123.36,58.19 122.43,58.19 C2.1 | 123.36,58.19 123.62,58.19 | v88.82,60.12 89.83,60.12 | R179.1 171.75,171.51 v171.75,171.5 | R178.1 184.07,159.19 v184.07,159.18 | 123.62,58.19 123.62,57.83 123.36,57.58 | R84.2 122.85,54.12 122.85,57.07 123.36,57.58 | 123.36,58.19 123.36,57.58 | 102.03,72.21 102.18,72.21 | 102.03,72.21 103.3,72.05 arc16 118.03,72.31 121.94,72.31 R85.2 | R84.2 119.91,52.6 v119.81,52.5 | v117.77,50.21 118.28,49.7 118.28,47.92 114.98,44.62 103.55,44.62 J1.14 J1.12 | v50.97,110.41 | v39.29,115.74 v24.05,115.74 | v179.58,101.6 178.55,100.57 C42.1 178.55,97.41 Q54.1 179.05,97.39 179.79,96.65 182.31,96.65 183.54,95.42 R8.2 184.83,94.81 v184.83,94.41 | v180,104.87 180,107.15 184.07,111.22 v184.07,111.86 172.87,111.86 R69.2 | v75.1,57.32 v70.02,57.32 | v55.8,56.05 v51.99,52.24 | v202.1,89.58 206.17,89.58 v208.2,87.55 | v76.33,70.49 81.45,75.61 v81.96,75.61 | v88.06,72.56 90.83,72.56 Q16.1 | C2.1 118.22,59.03 116.2,57.02 IC3.4 IC3.2
+5_UP
  Bottom 1.27: J1.26 J1.24 J1.22 J1.20 J1.18 J1.16
+5V  (via drill 0.3, 0.35, 0.5)
  Top 0.406: v146.22,127.68 146.73,127.17 v148.76,127.17 | L3.2 181.53,94.09 181.53,97.96 v182.54,98.98 | v117.01,60.88 121.33,60.88 121.78,61.33 127.74,61.33 128.7,60.37 134.65,60.37 v135.61,61.33 | v149.02,61.64 151.56,59.1 163.24,59.1 166.03,56.31 v166.03,55.54 | v112.95,69.51 97.96,69.51 v91.61,75.86
  Top 0.813: L3.2 176.7,85.52 180.51,81.71 191.18,81.71 196.26,86.79 v201.59,86.79 | C54.+ 168.49,127.77 v168.83,127.43 179.5,138.09 v203.37,138.09
  Bottom 0.305: 85.01,64.69 85.01,66.97 84.75,67.23 R116.2 R115.2 85.01,64.69 | 85.01,64.69 85.01,59.61 | 85.01,59.61 85.01,54.53 | 85.01,54.53 85.01,53.41 R109.2 | R108.2 85.01,54.53 | 85.01,59.61 R114.2
  Bottom 0.406: C39.2 167.22,172.38 168.57,172.38 170.78,174.59 R148.2 | C40.2 179.41,160.45 181.27,160.45 183.31,162.48 R147.2 | C31.2 160.45,40.32 160.45,38.27 162.81,35.91 R139.2 163.24,34.14 | C11.2 153.75,186.19 155.87,184.07 157.65,184.07 159.68,186.1 161.45,186.1 R149.2 | 184.93,64.84 184.83,64.74 184.83,62.91 187.37,60.37 187.37,58.52 R141.2 | R134.2 63.67,13.38 65.03,16.1 66.24,16.33 70.07,15.06 C24.2 | R135.2 88.41,5.12 88.48,5.41 89.07,8.05 90.6,9.32 C15.2 | R136.2 116.25,3.73 116.25,6.27 117.52,7.79 C27.2 | 206.01,143.15 207.26,142.79 210.23,143.68 R145.2 | C35.2 211.75,117.52 212.52,116.76 215.06,116.76 R144.2 | R143.2 215.46,88.75 213.79,90.09 210.99,90.6 210.48,91.87 C36.2 | C19.2 202.61,67.48 203.37,65.96 205.91,64.43 R142.2 | 151.89,20.4 R138.2 | R82.2 R83.2 133.01,55.04 | R109.2 R108.2 | 55.04,116 54.47,116.57 R103.2 56.64,116.57 | 56.64,116.57 R102.2 58.25,115.23 62.79,115.23 64.14,116.58 | R101.2 64.14,116.58 | 64.14,116.58 R95.2 69.23,116.58 R96.2 69.24,123.34 93.64,147.75 126.16,147.75 v146.22,127.68 | 161.72,124.38 167.66,124.38 R77.2 169.08,127.17 v168.83,127.43 | 161.72,124.38 155.26,124.38 R75.2 R65.2 | R65.2 R74.2 v148.76,127.17 | R137.2 C28.2 | 204.6,84.75 204.9,84.75 | 133.01,67.74 133.01,69.77 133.52,70.28 R88.2 R89.2 133.01,67.74 | 133.01,67.74 133.01,60.12 | 133.01,60.12 133.01,55.04 | 133.01,55.04 133.01,53.92 R82.2 | 133.01,60.12 R90.2 135.61,61.29 v135.61,61.33 | R140.2 175.18,48.18 172.89,50.46 172.89,52.7 C20.2 | R65.2 151.3,127.87 C48.1 | R76.2 161.72,125.55 161.72,124.38 | C1.1 56.64,119.15 56.64,116.57 | v182.54,98.98 183.2,98.98 R7.2 | R82.2 136.32,52.5 139.11,55.29 139.11,57.58 145.46,63.93 146.73,63.93 v149.02,61.64
  Bottom 0.406: v166.03,55.54 169.34,52.24 169.34,51.99 | v91.61,75.86 89.58,73.83 85.52,73.83 85.01,73.32 85.01,66.97 | v112.95,69.51 117.03,65.44 IC3.3 117.01,63.2 v117.01,60.88
  Bottom 0.813: 120.92,11.35 C27.2 | 94.4,11.12 81.89,11.02 76.98,15.93 71.29,15.93 C24.2 | 94.4,11.12 120.92,11.35 | C28.2 139.17,8.21 | 138.86,8.81 139.17,8.21 | C15.2 94.4,11.12 | 151.89,20.4 C32.2 151.26,17.5 150.78,17.25 141.4,12.36 137.59,10.84 | R138.2 150.29,22.19 150.29,23.54 146.98,26.84 146.98,29.64 161.08,43.73 | 161.08,43.73 169.34,51.99 173.4,56.05 | 173.4,56.05 182.19,64.84 184.93,64.84 C23.2 186.35,67.49 186.35,68.5 187.88,70.02 193.47,70.02 194.99,68.5 200.07,68.5 201.63,70.77 | C31.2 161.08,43.71 161.08,43.73 | C20.2 173.4,56.05 | 201.63,70.77 205.66,76.63 210.23,80.44 C53.1 209.94,84.75 | 209.94,84.75 208.71,90.6 208.71,95.68 | 208.71,95.68 208.71,121.08 | 208.71,121.08 206.6,138.34 | 206.6,138.34 206.01,143.15 C16.2 200.93,146.62 R146.2 196.32,149.02 190.67,149.02 C12.2 188.21,150.29 186.61,150.29 175.69,161.21 | C35.2 208.71,121.08 | C36.2 208.71,95.68 | C19.2 201.63,70.77 | 175.69,161.21 163.37,173.53 | 163.37,173.53 164.61,174.77 C39.2 | C40.2 175.69,161.27 175.69,161.21 | 163.37,173.53 153.24,183.65 C11.2 | 139.17,8.21 137.59,10.84 | 137.59,10.84 120.92,11.35 | v201.59,86.79 202.56,86.79 R4.3 204.6,84.75 | 204.9,84.75 209.94,84.75 | v203.37,138.09 206.36,138.09 206.6,138.34
+5V_UP  (via drill 0.5)
  Top 0.813: L2.2 123.04,55.04 v121.58,55.04 | v120.06,54.02 117.52,51.48 v114.22,51.48 | v101.26,54.02 100.35,53.11 v97.94,53.11 | v90.6,56.31 87.7,56.31 | 87.7,56.31 R5.2 | v81.71,52.75 v75.61,52.75 | v70.78,56.31 67.23,56.31 v59.35,48.43 | v82.11,56.94 82.14,56.94 82.68,57.49 86.52,57.49 87.7,56.31
  Top 1.27: L2.2 136.17,56.37 C51.+
  Bottom 0.406: 32.54,160.45 R122.2 32.27,158.07 36.49,153.84 | 44.88,163.88 C14.2 | C10.2 106.09,173.65 106.85,174.42 106.85,177.57 R119.2 | 58.92,31.92 58.85,31.92 | R129.2 8.3,75.61 11.35,76.37 C17.2 | R128.2 2.52,102.53 6.78,102.53 7.8,101.51 C18.2 | C25.2 64.87,34.21 62.75,34.21 61.36,32.82 59.82,32.82 58.93,31.94 | C29.2 122.93,173.73 124.12,174.92 124.12,177.57 R120.2 | 72.73,188.39 C37.2 | R117.2 89.33,177.57 89.33,172.13 | 44.88,172.36 R123.2 44.61,170.87 48.94,166.54 49.19,166.54 | R124.2 56.81,183.05 61.13,178.73 61.13,178.48 | 15.9,151.12 15.99,151.47 | 15.99,151.47 | 15.99,151.47 16.43,153.08 16.17,154.1 13.63,154.86 R126.2 | C30.2 8.81,126.16 7.79,128.19 5.04,128.74 R127.2 | R131.2 36.09,56.67 40.69,61.26 40.94,61.26 | R132.2 48.37,44.3 53,48.94 53,49.19 | 58.92,31.92 R133.2 58.93,31.94 | 58.93,31.94 58.92,31.92
  Bottom 0.813: R121.2 143.68,178.99 144.7,177.97 144.7,174.42 143.94,173.65 C33.2 137.01,173.08 136.06,172.13 119.3,172.13 | 119.3,172.13 102.03,172.13 | 102.03,172.13 89.33,172.13 84.25,172.13 | R125.2 72.73,187.99 72.73,188.39 | C37.2 75.36,186.1 75.36,183.31 72.82,180.77 | 72.82,180.77 63.42,180.77 61.13,178.48 57.96,175.31 | 57.96,175.31 49.19,166.54 45.64,162.99 | 45.64,162.99 36.49,153.84 33.45,150.79 | C14.2 45.64,163.11 45.64,162.99 | C38.2 57.83,175.31 57.96,175.31 | C10.2 101.96,172.2 102.03,172.13 | C29.2 119.28,172.14 119.3,172.13 | 11.09,123.87 11.35,126.66 15.92,146.22 16.68,148.76 C34.2 15.67,150.28 15.9,151.12 20.24,150.54 27.35,150.54 28.62,149.27 31.92,149.27 33.45,150.79 | 11.09,123.87 10.08,99.49 | 10.08,99.49 14.14,78.91 | C17.2 14.14,78.91 | C18.2 10.08,99.49 | C30.2 11.05,123.83 11.09,123.87 | R130.2 26.25,68.96 C21.2 29.33,71.04 30.91,71.04 | C25.2 67.48,32.73 67.48,34.72 56.31,45.89 | 30.91,71.04 31.16,71.04 40.94,61.26 43.86,58.34 | 43.86,58.34 53,49.19 56.31,45.89 | C26.2 56.31,45.71 | 56.31,45.71 56.31,45.89 | C22.2 43.86,58.17 43.86,58.34 | 72.82,180.77 81.45,172.13 84.25,172.13 | C9.2 84.43,172.32 84.25,172.13 | 30.91,71.04 32.15,72.28 32.15,72.84 30.42,74.57 27.91,74.57 24.51,71.17 19.4,71.17 17.55,71.34 14.14,78.91 | C13.2 32.04,152.2 33.45,150.79 | v121.58,55.04 121.08,55.04 v120.06,54.02 | v114.22,51.48 111.46,48.72 R3.3 108.85,48.72 106.85,50.72 102.53,50.72 101.58,51.67 C50.1 101.58,53.7 v101.26,54.02 | v97.94,53.11 94.74,56.31 v90.6,56.31 | v75.61,52.75 74.34,52.75 v70.78,56.31 | v59.35,48.43 56.63,45.71 56.31,45.71 | v81.71,52.75 81.71,56.54 v82.11,56.94
+12V  (via drill 0.5, 0.8 pad 1.3, 1, 1 pad 1.3)
  Top 0.152: C7.+ 96.95,158.66 96.43,158.66 96.26,158.49
  Top 0.406: R1.2 140.71,161.79 SOLENOID_CON.P 138.61,160.69 137.59,161.72
  Top 0.813: v102.53,54.53 102.53,52.75 94.66,44.88 J1.10
  Top 1.27: v69.9,147.37 69.9,137.97 71.55,136.32 75.36,136.32 86.79,147.75 90.6,147.75 99.49,156.64 97.46,158.66 96.95,158.66 | C8.+ 64.96,90.36 74.34,80.97 74.34,80.94 | C6.+ 126.55,147.35 133.78,140.13 v137.59,140.13 | v73,81.71 73.58,81.71 74.34,80.94 | 74.34,80.94 76.63,78.66 79.42,78.66 80.94,77.13 80.94,73.83 88.56,66.21 88.56,66.63 C49.+ 90.51,64.69 101.52,64.69 104.06,62.15 v104.06,61.89 | v194.74,92.12 194.74,97.71 192.45,99.99 179.75,99.99 175.18,104.57 172.38,104.57 171.11,103.3 171.11,96.03 170.96,96.03 v160.95,86.02
  Top 2.54: C5.+ 151.74,99.42 147.24,94.91 v147.24,87.55 v147.24,81.2
  Top 5: C6.+ 118,154.6 | 118,154.6 100.15,154.6 96.26,158.49 94.41,160.35 94.41,160.45 93.14,161.72 66.47,161.72 55.04,150.29 55.04,142.67 62.66,135.05 62.66,92.66 64.96,90.36 | 118,154.6 125.11,161.72 137.59,161.72 | 137.59,161.72 155.37,143.94 | 155.37,137.59 155.37,143.94 | 137.59,161.72 139.83,161.72 | 155.37,143.94 157.91,141.4 | 157.91,141.4 193.85,141.4 U2.P | 157.91,141.4 157.91,140.13 155.37,137.59 | C5.+ 151.74,117.45 155.37,121.08 155.37,137.59
  Bottom 0.813: MOTOR_A_DRV.P$23 v69.9,147.37 | v69.9,147.37 69.52,147.75 62.45,147.75 MOTOR_A_DRV.P$3 | v69.9,147.37 69.9,154.44 MOTOR_A_DRV.P$13 | MOTOR_C_DRV.P$23 73,75.36 | MOTOR_C_DRV.P$13 80.07,75.36 73,75.36 | MOTOR_C_DRV.P$3 73,82.43 v73,81.71 73,75.36 | 145.7,76.63 MOTOR_D_DRV.P$23 | MOTOR_D_DRV.P$3 138.62,76.63 145.7,76.63 | MOTOR_D_DRV.P$13 145.7,83.7 145.7,79.67 145.7,76.63 | 147.75,149.74 MOTOR_B_DRV.P$23 138.13,140.13 v137.59,140.13 | MOTOR_B_DRV.P$3 147.75,156.81 147.75,149.74 | MOTOR_B_DRV.P$13 154.82,149.74 147.75,149.74 | v102.53,54.53 102.53,56.54 U8.5
  Bottom 1.27: v147.24,81.2 145.71,79.67 145.7,79.67 | U8.5 U8.4 104.14,61.82 v104.06,61.89 | U9.5 U9.4 194.74,86.94 v194.74,92.12 | v160.95,86.02 148.76,86.02 v147.24,87.55
EN_A  (via drill 0.35)
  Top 0.406: v69.26,101.26 69.26,102.79 v67.23,104.82 | v62.91,82.21 74.36,70.77 74.36,50.96 79.44,45.88 79.44,40.8 83.74,36.49 85.52,36.49 87.04,38.02 J1.03
  Bottom 0.406: Q9.2 67.63,107.81 R97.1 66.38,105.67 v67.23,104.82 | v69.26,101.26 57.07,89.07 57.07,88.06 v62.91,82.21
EN_B  (via drill 0.35)
  Top 0.406: v162.73,107.87 163.24,107.36 163.24,106.16 166.8,102.6 166.8,96.44 141.78,71.42 141.78,62.08 v153.24,50.62 | v145.71,34.21 145.71,33.98 139.39,27.66 139.31,27.66 v139.11,27.86 | J1.11 97.2,34.46 v99.49,32.18
  Bottom 0.406: Q1.2 148.57,116.03 R66.1 155.47,109.14 161.46,109.14 v162.73,107.87 | v153.24,50.62 154.1,49.76 154.1,45.64 146.86,38.4 146.86,35.36 v145.71,34.21 | v139.11,27.86 134.94,32.03 99.63,32.03 v99.49,32.18
EN_C  (via drill 0.35)
  Top 0.406: v98.88,46.81 102.72,42.97 133.9,42.97 136.44,40.43 139.74,40.43 140.63,39.54 140.63,37.48 137.36,34.21 118.28,34.21 116.25,36.24 109.39,36.24 J1.19
  Bottom 0.305: Q13.2 93.35,51.8 R110.1
  Bottom 0.406: R110.1 97.35,52.09 97.96,51.48 97.96,47.73 v98.88,46.81
EN_D  (via drill 0.35)
  Top 0.406: v136.06,36.31 136.06,36.26 134.77,34.97 118.79,34.97 117.52,36.24 J1.27
  Bottom 0.406: R84.1 125.89,55.44 Q5.2 128.19,53.15 128.19,52.43 136.57,44.05 136.57,36.82 v136.06,36.31
GND  (via drill 0.3, 0.35, 0.5, 0.8 pad 1.3, 1)
  Top 0.203: v188.64,153.08 179.5,162.22 179.5,162.68 179.19,162.99 178.73,162.99 v176.45,165.27 167.3,174.42 167.3,174.63 167.01,174.92 166.8,174.92 v164,177.72 v160.45,181.27 | v159.18,182.04 156.13,185.08 156.13,186.31 155.83,186.61 155.11,186.61 v152.83,188.89 151.15,188.89 139.21,176.96 v135.05,176.96 v117.52,176.96 v100.25,176.96 v82.72,176.96 81.2,176.96 69.01,189.15 v64.43,189.15 v52.75,177.46 v40.56,165.27 v28.37,153.08 v26.33,152.14 | v207.18,150.03 207.44,149.52 arc-23 v214.29,123.62 214.55,122.6 arc-27 v214.8,97.2 | v214.8,97.2 214.8,96.44 arc-30 v207.94,70.78 | v4.74,95.68 arc22 11.86,69.77 v12.11,69.26 14.35,67.03 27.55,67.03 30.14,64.43 | v4.74,95.68 4.49,96.95 arc-24 v4.74,122.09 4.74,123.62 arc-31 v11.6,148.76 | v191.18,65.96 v178.99,53.77 v166.54,41.32 v154.35,29.13 151.05,25.83 151.05,12.87 v150.03,12.36 149.52,12.11 arc-23 v123.36,5 122.09,4.74 arc-24 v95.68,5 93.9,5.25 arc-14 v70.53,11.6 61.39,15.67 61.39,16.4 65.96,20.75 67.99,25.32 67.84,25.86 67.48,27.1 v66.21,28.37 v54.27,40.3 v41.83,52.75 30.14,64.43 | 30.14,64.43 v30.14,64.69 | v13.63,148.25 14.4,150.54 v16.94,151.81 | v4.74,95.68 5.51,94.91 v5.98,94.91 | v7.54,94.91 v31.74,109.39 | v32.18,107.36 33.69,107.36 IC1.12 | v208.2,86.53 v210.74,86.02 | v213.53,87.8 214.29,96.44 v214.8,97.2
  Top 0.406: v98.47,60.88 99.87,59.47 v100.83,59.47 | v118.79,62.15 118.54,62.4 118.54,62.66 | v82.29,63.42 81.64,62.77 81.64,61.39 | C41.2 81.64,61.39 | 81.64,61.39 81.39,61.64 v77.39,61.64 | C49.- 96.44,66.72 | IC1.12 35.46,107.34 36.49,108.38 38.02,108.38 | 38.02,108.38 39.29,108.38 39.55,108.64 IC1.15 46.64,108.64 | 38.02,108.38 38.04,108.4 38.04,117.29 39.22,118.47 C4.2 v47.67,118.47 51.8,118.47 v51.99,118.28 | v158.24,128.7 159.51,129.96 159.51,130.3 | IC2.12 176.72,104.8 175.69,105.84 v171.62,105.84 | IC2.15 188.12,106.1 | 188.12,106.1 188.89,105.33 188.89,104.31 188.16,103.58 185.89,103.58 v185.85,103.62 | 188.12,106.1 188.4,106.1 191.18,108.88 v191.18,114.22 | v187.12,116.25 187.05,116.18 C3.2 | v159.18,182.04 v156.13,178.99 | v158.41,160.19 158.41,159.11 C47.2 | v118.79,60.12 118.79,57.83 v119.04,57.58 | v106.85,48.69 v108.88,50.72
  Top 0.813: Q49.3 96.95,58.34 101.26,58.34 v108.88,50.72 | Q53.3 175.43,101.52 177.06,99.89 D35.2 177.46,96.95 v179.24,98.72 | v198.8,89.58 188.64,89.58 v184.83,93.39 | C5.- 160.95,107.08 v160.95,109.9 | C54.- 164.51,118.45 v164.51,111.68
  Top 1.27: 78.76,144.95 v78.66,144.95 | v78.66,144.95 72.56,138.86 v72.56,138.6 | C8.- v58.2,80.44 58.2,79.05 v64.18,73.07 v70.02,67.23 | 115.89,62.66 D34.2 113.05,60.12 112.19,60.12 v112.19,58.08 | 115.89,62.66 118.54,62.66 136.48,62.66 C51.- 137.33,62.15 138.35,61.13 v138.35,60.62 | v129.2,154.86 130.84,153.22 C6.- 137.11,147.24 v138.6,147.24 v144.44,141.4 v151.81,134.03 | v158.82,130.98 159.51,130.3 v162.73,127.07 162.73,122.26 C54.- | 96.44,66.72 96.18,66.47 v100.76,66.47 104.06,66.47 107.87,62.66 115.89,62.66 | C49.- 96.78,68.16 v74.21,90.72 66.47,98.47 v66.47,100.76 | v50.46,104.82 46.64,108.64 46.64,111.16 v46.65,111.17 | v78.66,144.95 86.5,152.79 C7.- 94.06,155.11 v94.15,155.11 | v144.95,65.45 159.18,79.67 v160.95,79.67
  Bottom 0.203: Q45.E 188.76,153.08 v188.64,153.08 | v176.45,165.27 177.07,165.9 Q46.E | v164,177.72 164.67,178.39 Q47.E | v160.45,181.27 159.68,182.04 v159.18,182.04 | Q44.E v207.18,150.03 | v214.29,123.62 Q43.E | v214.8,97.2 Q42.E | v207.94,70.78 Q41.E | Q36.E v150.03,12.36 | v123.36,5 Q35.E | v95.68,5 Q34.E | v70.53,11.6 Q33.E | Q25.E v12.11,69.26 | v4.74,95.68 Q26.E | v4.74,122.09 Q27.E | v11.6,148.76 12.62,148.52 | Q40.E 191.18,66.03 v191.18,65.96 | v178.99,53.77 178.97,53.77 Q39.E | v166.54,41.32 166.43,41.32 Q38.E | v154.35,29.13 154.15,29.13 Q37.E | Q32.E 66.71,28.87 v66.21,28.37 | v54.27,40.3 54.27,40.46 Q31.E | v41.83,52.75 41.83,53 Q30.E | v30.14,64.69 30.14,65.5 Q29.E | Q24.E 28.37,152.94 v28.37,153.08 | v40.56,165.27 40.79,165.27 41.32,164.74 | v52.75,177.46 52.8,177.46 Q22.E | v64.43,189.15 65.14,188.45 Q21.E | Q20.E 82.73,176.94 v82.72,176.96 | v100.25,176.96 100.26,176.94 Q19.E | v117.52,176.96 117.52,175.93 117.33,175.74 | v135.05,176.96 135.06,176.94 Q17.E | Q28.E v13.63,148.25 | v16.94,151.81 19.73,151.3 20.37,151.18 20.75,151.18 v26.33,152.14 | v5.98,94.91 v7.54,94.91 | v31.74,109.39 32.18,108.95 v32.18,107.36 | R4.1 v208.2,86.53 | v210.74,86.02 213.02,86.79 v213.53,87.8 | Q48.E 153.54,189.61 v152.83,188.89
  Bottom 0.406: 41.32,164.74 Q23.E | 117.33,175.74 Q18.E | 165.51,41.96 Q38.E | 12.62,148.52 Q28.E | 200.32,87.29 200.17,87.14 U9.1 | 117.11,52.66 C2.2 121.14,57.58 v119.04,57.58 | 119.1,61.59 119.65,62.15 C43.2 v118.79,62.15 | 119.1,61.59 118.71,61.21 | v118.79,62.15 118.71,62.07 118.71,61.21 | v118.79,62.15 119.1,61.84 119.1,61.59 | C44.2 98.4,60.94 v98.47,60.88 | v100.83,59.47 100.83,66.39 v100.76,66.47 | R107.2 82.24,68.42 82.24,63.47 v82.29,63.42 | v77.39,61.64 70.78,61.64 70.28,61.13 69.26,61.13 67.99,62.4 67.99,63.28 MOTOR_C_DRV.P$18 | R94.2 51.99,116.83 v51.99,118.28 53.58,118.28 C1.2 | C48.2 157.74,128.19 v158.24,128.7 | R73.2 v162.73,127.07 | v179.24,98.72 180.45,99.93 C42.2 181.59,101.65 182.93,101.65 184.9,103.62 v185.85,103.62 | v171.62,105.84 171.62,101.52 Q53.3 | v191.18,114.22 189.15,116.25 v187.12,116.25 | v156.13,178.99 155.11,177.97 149.25,177.97 Q50.3 148.94,172.89 154.6,172.89 158.41,169.08 v158.41,160.19 | v138.35,60.62 137.48,60.62 R81.2 | 118.71,61.21 118.71,60.19 v118.79,60.12 | R3.1 106.82,48.72 v106.85,48.69
  Bottom 0.813: MOTOR_A_DRV.P$28 MOTOR_A_DRV.P$27 MOTOR_A_DRV.P$26 | MOTOR_B_DRV.P$19 MOTOR_B_DRV.P$18 | MOTOR_B_DRV.P$19 142.12,139.14 | MOTOR_B_DRV.P$19 MOTOR_B_DRV.P$20 | MOTOR_B_DRV.P$27 MOTOR_B_DRV.P$26 | MOTOR_B_DRV.P$27 136.79,145.17 | MOTOR_B_DRV.P$27 MOTOR_B_DRV.P$28 | MOTOR_C_DRV.P$28 MOTOR_C_DRV.P$27 MOTOR_C_DRV.P$26 | MOTOR_C_DRV.P$20 MOTOR_C_DRV.P$19 MOTOR_C_DRV.P$18 | MOTOR_A_DRV.P$20 MOTOR_A_DRV.P$19 MOTOR_A_DRV.P$18 | MOTOR_D_DRV.P$28 MOTOR_D_DRV.P$27 MOTOR_D_DRV.P$26 | MOTOR_D_DRV.P$20 156.03,70.88 MOTOR_D_DRV.P$19 157.05,71.9 MOTOR_D_DRV.P$18 | R4.1 204.63,88.31 201.34,88.31 | 201.34,88.31 200.32,87.29 | 201.34,88.31 200.07,88.31 v198.8,89.58 | v184.83,93.39 172.38,93.39 171.62,94.15 | 114.22,156.38 123.62,165.78 137.33,165.78 139.36,167.81 139.36,170.86 140.89,172.38 145.21,172.38 146.55,173.73 Q50.3 | v160.95,109.9 160.95,110.73 | C46.2 160.95,110.73 | 164.51,111.42 v164.51,111.68 164.51,111.17 164.07,110.73 160.95,110.73
  Bottom 1.27: v78.66,144.95 80.43,143.18 MOTOR_A_DRV.P$19 | v72.56,138.6 74.33,136.83 MOTOR_A_DRV.P$27 | v144.44,141.4 142.81,139.76 MOTOR_B_DRV.P$19 | v138.6,147.24 136.79,145.42 136.79,145.17 | v64.18,73.07 62.65,71.54 MOTOR_C_DRV.P$27 | v70.02,67.23 68.3,65.51 MOTOR_C_DRV.P$19 | MOTOR_D_DRV.P$27 151.67,64.99 153.39,64.99 157.65,69.26 | 157.65,69.26 158.29,69.9 | v129.2,154.86 127.68,156.38 114.22,156.38 95.42,156.38 v94.15,155.11 | v151.81,134.03 154.86,130.98 v158.82,130.98 | v144.95,65.45 140.13,60.62 v138.35,60.62 | J1.32 122.6,47.16 117.11,52.66 | 157.27,70.71 MOTOR_D_DRV.P$19 156.77,71.41 158.29,69.9 | Q53.3 172.38,101.52 171.62,100.76 171.62,94.15 171.62,90.34 v160.95,79.67 160.95,72.56 158.92,70.53 | v66.47,100.76 65.4,101.82 C45.2 53.46,101.82 v50.46,104.82 | v46.65,111.17 46.65,117.52 49.75,120.61 SWITCH_CON.N | J1.28 J1.30 J1.32 | J1.32 J1.34 J1.36 J1.38 J1.40 | v58.2,80.44 59.47,79.17 62.66,79.17 v74.21,90.72 | 158.29,69.9 158.92,70.53 | IC3.1 112.19,62.98 v112.19,58.08 112.01,57.91 110.51,57.91 U8.1 109.65,56.23 109.65,51.48 v108.88,50.72 | 157.65,69.26 | 157.65,69.26 156.03,70.88 | 158.92,70.53 158.41,70.53 157.05,71.9
  pour Bottom (isolate 0.254, no thermals): -35.13,241.73 -35.13,-32.59 259.51,-32.59 259.51,241.73
  pour Top (isolate 0.254, no thermals): -31.32,229.03 -31.32,-35.13 253.16,-35.13 253.16,229.03
IN1_A  (via drill 0.35)
  Top 0.406: v59.35,106.34 59.35,95.17 v58.85,94.66 | v62.25,81.55 73.42,70.38 73.42,50.57 78.5,45.49 78.5,40.66 83.35,35.81 87.43,35.81 89.58,37.96 J1.05
  Bottom 0.406: Q10.2 62.32,108.04 R98.1 59.49,106.48 v59.35,106.34 | v58.85,94.66 56.31,92.12 56.31,87.49 v62.25,81.55
IN1_B  (via drill 0.35)
  Top 0.406: v158.41,118.28 159.94,116.76 159.94,113.96 164,109.9 164,106.48 167.56,102.92 167.56,96.18 142.5,71.13 142.5,62.61 v153.86,51.25 | v146.34,33.58 139.73,26.98 v139.11,26.98 | v102.03,31.16 99.74,33.45 J1.13
  Bottom 0.406: R67.1 154.42,115.78 Q2.2 155.48,119.55 157.14,119.55 v158.41,118.28 | v153.86,51.25 154.81,50.3 154.81,45.34 147.58,38.11 147.58,34.82 v146.34,33.58 | v139.11,26.98 138.74,26.98 134.57,31.15 v102.04,31.15 v102.03,31.16
IN1_C  (via drill 0.35)
  Top 0.406: v99.51,47.44 103.17,43.78 134.23,43.78 136.77,41.24 140.07,41.24 141.44,39.88 141.44,37.27 137.82,33.66 117.31,33.66 115.49,35.48 v111.42,35.48
  Bottom 0.305: R111.1 91.11,57.93 Q14.2
  Bottom 0.406: R111.1 97.86,57.93 98.72,57.07 98.72,48.22 v99.51,47.44 | J1.21 109.9,37 v111.42,35.48
IN1_D  (via drill 0.35)
  Top 0.406: v135.3,36.49 135.29,36.49 134.29,35.5 121.08,35.5 120.06,36.52 J1.29 | v129.27,50.27 138.16,50.27 140.89,53 140.89,66.97 134.79,73.07 v128.44,73.07
  Bottom 0.406: Q6.2 126.73,73 126.67,73.07 | R85.1 124.67,73 Q6.2 | v135.3,36.49 135.81,37 135.81,43.73 v129.27,50.27 | v128.44,73.07 128.38,73 Q6.2
IN2_A  (via drill 0.35)
  Top 0.406: v55.04,104.82 55.54,104.31 v55.54,97.71 | v61.59,80.89 72.48,69.99 72.48,50.18 77.56,45.1 77.56,40.53 82.96,35.13 89.23,35.13 92.12,38.02 J1.07
  Bottom 0.406: Q11.2 55.87,107.51 R99.1 54.91,104.95 v55.04,104.82 | v55.54,97.71 55.52,97.68 55.52,86.96 v61.59,80.89
IN2_B  (via drill 0.35)
  Top 0.406: v160.7,114.22 164.76,110.15 164.76,106.79 168.57,102.98 168.57,96.18 143.22,70.83 143.22,63.14 v154.49,51.87 | v146.96,32.96 140.1,26.09 v139.11,26.09 | J1.15 102.28,32.12 v104.18,30.22
  Bottom 0.406: Q3.2 161.27,116.47 R68.1 160.55,114.37 v160.7,114.22 | v154.49,51.87 155.53,50.83 155.53,45.04 148.3,37.81 148.3,34.29 v146.96,32.96 | v139.11,26.09 138.38,26.09 134.2,30.27 104.23,30.27 v104.18,30.22
IN2_C  (via drill 0.35)
  Top 0.406: v100.13,48.06 103.61,44.58 134.57,44.58 137.11,42.04 140.41,42.04 142.24,40.21 142.24,37.07 138.03,32.86 116.33,32.86 v114.98,34.21
  Bottom 0.305: R112.1 92.41,64.75 Q15.2
  Bottom 0.406: R112.1 94.05,63.93 98.98,63.93 99.49,63.42 99.49,48.45 99.88,48.06 v100.13,48.06 | J1.23 112.44,36.75 v114.98,34.21
IN2_D  (via drill 0.35)
  Top 0.406: 134.15,36.37 133.82,36.04 | 133.82,36.04 123.11,36.04 122.6,36.55 J1.31 | 133.82,36.04 133.83,36.04 v134.79,37 | v127.68,50.97 137.84,50.97 140.13,53.26 140.13,66.72 137.84,69.01 131.49,69.01 v128.7,66.21
  Bottom 0.152: R86.1 123.85,67.4
  Bottom 0.406: R86.1 126.4,66.87 Q7.2 127.19,66.21 v128.7,66.21 | v134.79,37 135,37.21 135,37.22 135.05,37.27 135.05,43.41 127.68,50.78 v127.68,50.97
KICKER  (via drill 0.3)
  Top 0.203: R2.1 v160.7,162.96 | v171.17,114.83 166.08,109.75 v166.08,108.63 | v166.06,88.08 166.06,73.3 154.58,61.82 v149.93,61.82 | v94.03,34.26 99.64,28.65 134.61,28.65 v136.95,30.98 | v139.57,28.67 145.08,34.18 145.08,34.49 146.91,36.32 146.91,38.32 153.41,44.83 v153.41,46.04 | v152.57,50.08 145.59,57.06 v145.59,57.48
  Top 0.406: Q51.2 160.7,166.43 R2.1
  Bottom 0.203: v160.7,162.96 163.06,160.6 163.06,155.09 185.52,132.63 185.52,120.11 182.49,117.09 173.43,117.09 v171.17,114.83 | v166.08,108.63 166.08,88.1 v166.06,88.08 | v149.93,61.82 v145.59,57.48 | J1.01 84.5,37.05 87.29,34.26 v94.03,34.26 | v136.95,30.98 139.26,28.67 v139.57,28.67 | v153.41,46.04 153.41,49.25 v152.57,50.08
LED_ENABLE  (via drill 0.35)
  Top 0.406: R6.1 76.63,55.04 79.56,55.04 Q52.2 79.63,54.06 v79.67,54.02 | v117.52,48.76 137.66,48.76 v144.95,56.05 | v152.32,63.42 153.84,63.42 164.26,73.83 164.26,87.8 170.86,94.41 v178.48,94.41 | v89.07,44.11 92.12,41.07 J1.08
  Bottom 0.406: v89.07,44.11 83.74,44.11 79.67,48.18 v79.67,54.02 | v117.52,48.76 117.45,48.69 114.98,48.69 111.68,45.38 96.69,45.38 J1.08 | v144.95,56.05 v152.32,63.42 | v178.48,94.41 178.48,95.44 Q54.2 181.31,95.49 R8.1
LIGHT_I0  (via drill 0.4)
  Top 0.406: v138.86,174.67 138.86,171.62 TP1.TP 134.79,167.56 103.8,167.56 102.28,166.03 81.2,166.03 79.17,168.07 67.74,168.07 37.51,137.84 37.51,110.92 35.89,109.29 IC1.9
  Bottom 0.406: Q17.C 138.86,175.94 | 138.86,175.94 R118.2 | v138.86,174.67 138.86,175.94
LIGHT_I1  (via drill 0.4)
  Top 0.406: v121.08,174.92 121.08,171.37 TP2.TP 118.79,169.08 104.31,169.08 102.03,166.8 81.45,166.8 79.42,168.83 67.74,168.83 36.79,137.88 36.79,111.21 35.52,109.94 IC1.8
  Bottom 0.406: R150.2 121.08,175.94 | 121.08,175.94 Q18.C | 121.08,175.94 v121.08,174.92
LIGHT_I2  (via drill 0.4)
  Top 0.406: v103.3,174.92 103.3,170.86 TP3.TP 101.77,169.08 100.25,167.56 81.71,167.56 79.67,169.59 67.48,169.59 36.07,138.18 36.07,111.51 35.15,110.59 IC1.7
  Bottom 0.406: R151.2 103.3,175.69 | 103.3,175.69 102.01,175.69 Q19.C | 103.3,175.69 v103.3,174.92
LIGHT_I3  (via drill 0.4)
  Top 0.406: v86.79,174.42 86.79,169.69 | IC1.6 34.79,111.24 35.36,111.81 35.36,138.48 67.23,170.35 79.93,170.35 81.2,169.08 86.79,169.08 | 86.79,169.08 87.55,169.08 TP4.TP | 86.79,169.69 86.79,169.34 | 86.79,169.34 86.79,169.08 | TP4.TP 86.79,169.34 | TP4.TP 87.14,169.34 86.79,169.69
  Bottom 0.406: Q20.C 86.79,175.94 | 86.79,175.94 R152.2 | 86.79,175.94 v86.79,174.42
LIGHT_I4
  Top 0.406: IC1.5 30.69,111.89 28.75,113.83 28.75,139.99 72.19,183.42 TP5.TP
  Bottom 0.406: Q21.C 66.71,188.82 R153.2 68.89,186.22 71.43,183.68 TP5.TP
LIGHT_I5  (via drill 0.35, 0.4)
  Top 0.406: IC1.4 31.06,112.54 29.47,114.13 29.47,139.71 v57.32,167.56 | v58.85,180 v60.12,181.27 | v61.13,180.26 61.84,179.55 TP6.TP
  Bottom 0.406: v57.32,167.56 61.84,172.08 TP6.TP | v58.85,180 57.9,180 R154.2 57.15,180.52 Q22.C | v60.12,181.27 v61.13,180.26
LIGHT_I6  (via drill 0.3, 0.35)
  Top 0.406: IC1.3 31.43,113.19 30.19,114.43 30.19,134.33 v47.42,151.56 | v45.89,167.05 45.89,161.97 TP7.TP
  Bottom 0.406: v47.42,151.56 47.42,160.45 TP7.TP | R155.2 45.54,167.81 | R155.2 45.89,167.46 v45.89,167.05 | Q23.C 44.85,168.3 R155.2
LIGHT_I7  (via drill 0.35, 0.4)
  Top 0.406: IC1.2 31.79,113.84 30.91,114.73 v30.91,134.03 | v32.94,154.35 33.19,154.35 34.89,152.65 TP8.TP
  Bottom 0.406: Q24.C 32.44,155.81 R156.2 32.44,154.85 v32.94,154.35 | v30.91,134.03 30.91,144.95 TP8.TP
LIGHT_I8  (via drill 0.35, 0.4)
  Top 0.406: v12.36,73.58 16.16,77.37 TP9.TP | v43.61,114.73 42.72,113.84 IC1.23
  Bottom 0.406: R157.2 11.62,72.72 | 11.62,72.72 Q25.C | 11.62,72.72 12.36,73.46 v12.36,73.58 | v43.61,114.73 43.61,116 42.34,117.27 24.56,117.27 14.4,107.11 14.4,81.71 TP9.TP
LIGHT_I9  (via drill 0.35, 0.4)
  Top 0.406: v6.78,99.74 10.8,99.74 TP10.TP | v43.61,113.48 43.32,113.19 IC1.22